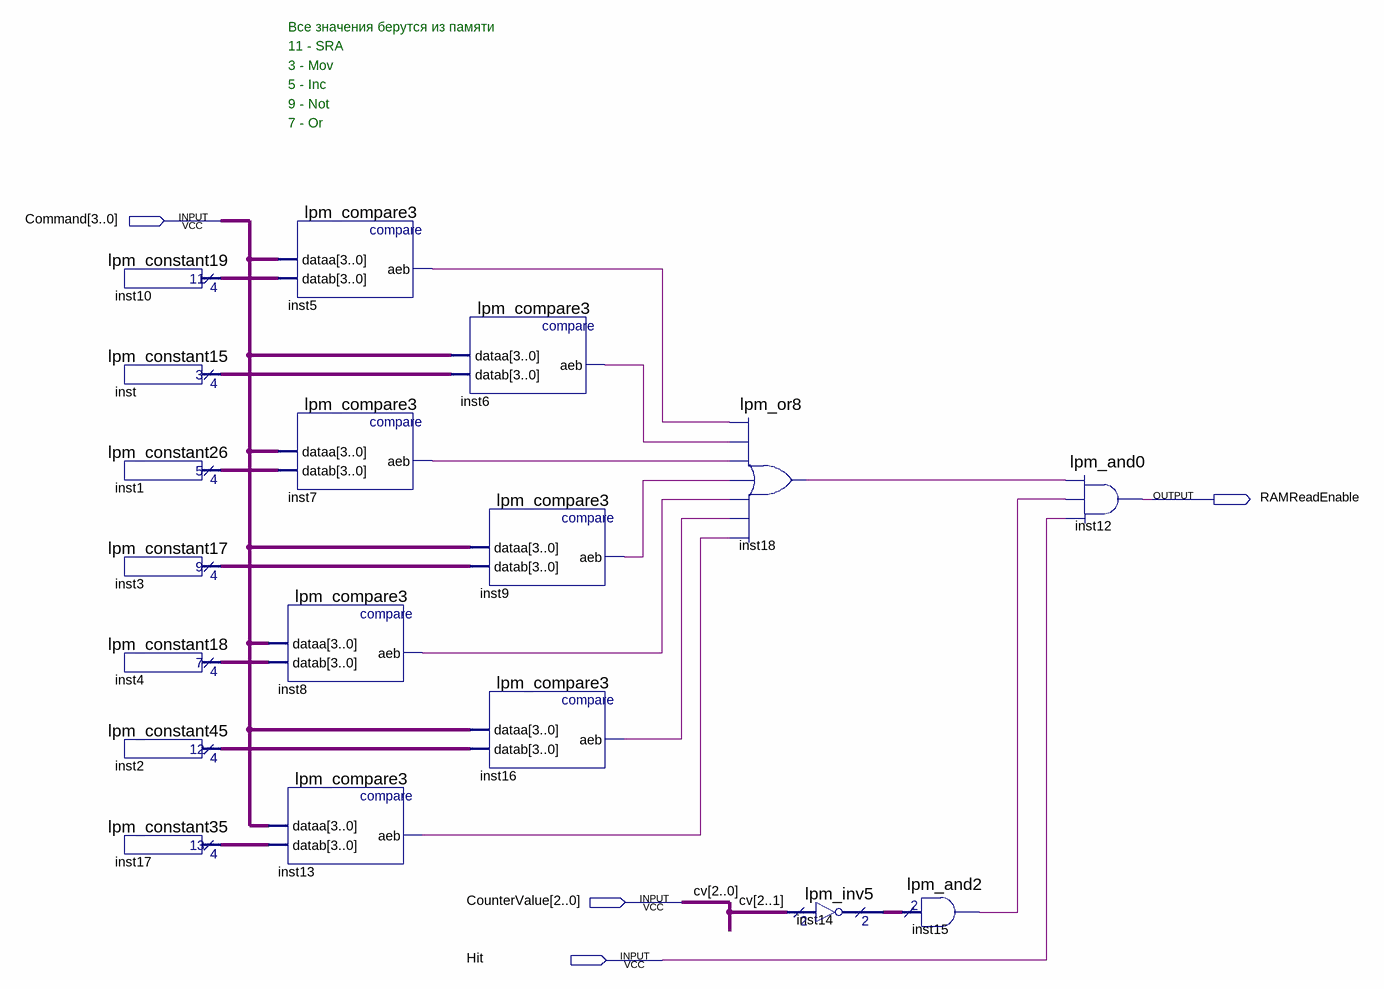
[diagram p0: schematic sheet]
// Quartus schematic RamEnable.bdf as structural Verilog: 18 symbols, 4 pins
module RamEnable (
  input  [3:0] Command,
  input  [2:0] CounterValue,
  input  Hit,
  output RAMReadEnable
);

  wire inst5_aeb, inst6_aeb, inst7_aeb, inst8_aeb, inst9_aeb, inst13_aeb, inst15_result, inst16_aeb,
       inst18_result;
  wire [1:0] inst14_result;
  wire [3:0] inst1_result, inst2_result, inst3_result, inst4_result, inst10_result, inst17_result,
       inst_result;

  lpm_constant19 inst10 (.result(inst10_result));
  lpm_constant15 inst (.result(inst_result));
  lpm_constant26 inst1 (.result(inst1_result));
  lpm_constant17 inst3 (.result(inst3_result));
  lpm_constant18 inst4 (.result(inst4_result));
  lpm_constant45 inst2 (.result(inst2_result));
  lpm_constant35 inst17 (.result(inst17_result));
  lpm_compare3 inst5 (.dataa(Command), .datab(inst10_result), .aeb(inst5_aeb));
  lpm_compare3 inst7 (.dataa(Command), .datab(inst1_result), .aeb(inst7_aeb));
  lpm_compare3 inst8 (.dataa(Command), .datab(inst4_result), .aeb(inst8_aeb));
  lpm_compare3 inst13 (.dataa(Command), .datab(inst17_result), .aeb(inst13_aeb));
  lpm_compare3 inst6 (.dataa(Command), .datab(inst_result), .aeb(inst6_aeb));
  lpm_compare3 inst9 (.dataa(Command), .datab(inst3_result), .aeb(inst9_aeb));
  lpm_compare3 inst16 (.dataa(Command), .datab(inst2_result), .aeb(inst16_aeb));
  lpm_or8 inst18 (
    .data0(inst5_aeb), .data1(inst6_aeb), .data2(inst7_aeb), .data3(inst9_aeb), .data4(inst8_aeb),
    .data5(inst16_aeb), .data6(inst13_aeb), .result(inst18_result));
  lpm_inv5 inst14 (.data(CounterValue[2:1]), .result(inst14_result));
  lpm_and2 inst15 (.data(inst14_result), .result(inst15_result));
  lpm_and0 inst12 (.data0(inst18_result), .data1(inst15_result), .data2(Hit), .result(RAMReadEnable));

  // Other names for the same wires on the sheet: cv[2:0] = CounterValue

  // Notes on the sheet:
  //   Все значения берутся из памяти
  //   11 - SRA
  //   3 - Mov
  //   5 - Inc
  //   9 - Not
  //   7 - Or
endmodule
